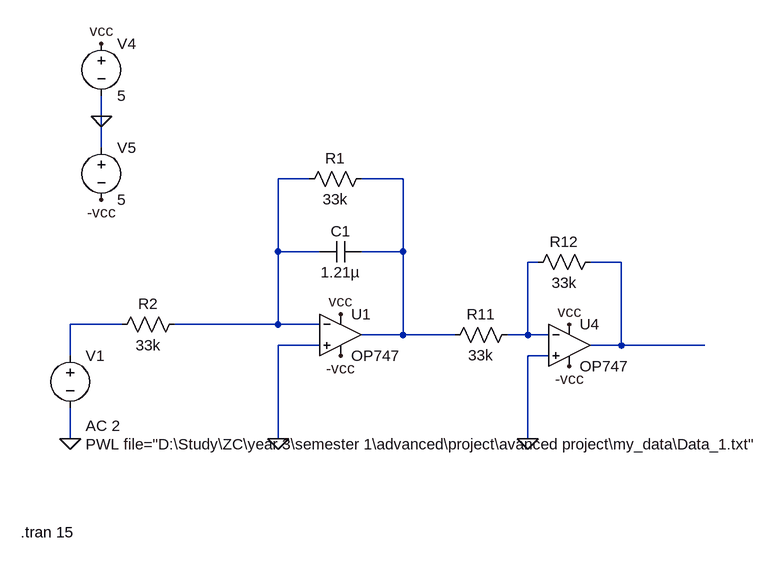
[diagram p0: schematic LTSpice.asc]
LTSpice.asc, the LTspice schematic file:
Version 4
SHEET 1 1144 680
WIRE -16 -16 -16 -48
WIRE -16 32 -16 -16
WIRE 304 80 256 80
WIRE 448 80 384 80
WIRE 256 192 256 80
WIRE 320 192 256 192
WIRE 448 192 448 80
WIRE 448 192 384 192
WIRE 656 208 640 208
WIRE 784 208 736 208
WIRE 16 304 -64 304
WIRE 256 304 256 192
WIRE 256 304 96 304
WIRE 320 304 256 304
WIRE 448 320 448 192
WIRE 448 320 384 320
WIRE 528 320 448 320
WIRE 640 320 640 208
WIRE 640 320 608 320
WIRE 672 320 640 320
WIRE 320 336 256 336
WIRE 784 336 784 208
WIRE 784 336 736 336
WIRE 912 336 784 336
WIRE -64 352 -64 304
WIRE 672 352 640 352
WIRE -64 480 -64 432
WIRE 256 480 256 336
WIRE 640 480 640 352
FLAG -16 -16 0
FLAG -16 -128 vcc
FLAG -16 112 -vcc
FLAG 352 288 vcc
FLAG 352 352 -vcc
FLAG -64 480 0
FLAG 256 480 0
FLAG 704 304 vcc
FLAG 704 368 -vcc
FLAG 640 480 0
SYMBOL res 400 64 R90
WINDOW 0 0 56 VBottom 2
WINDOW 3 32 56 VTop 2
SYMATTR InstName R1
SYMATTR Value 33k
SYMBOL cap 384 176 R90
WINDOW 0 0 32 VBottom 2
WINDOW 3 32 32 VTop 2
SYMATTR InstName C1
SYMATTR Value 1.21µ
SYMBOL res 112 288 R90
WINDOW 0 0 56 VBottom 2
WINDOW 3 32 56 VTop 2
SYMATTR InstName R2
SYMATTR Value 33k
SYMBOL OpAmps\\OP747 352 256 R0
SYMATTR InstName U1
SYMBOL voltage -64 336 R0
WINDOW 3 24 152 Left 2
WINDOW 123 24 124 Left 2
WINDOW 39 0 0 Left 0
SYMATTR Value PWL file="D:\Study\ZC\year 3\semester 1\advanced\project\avanced project\my_data\Data_1.txt"
SYMATTR Value2 AC 2
SYMATTR InstName V1
SYMBOL voltage -16 -144 R0
WINDOW 123 0 0 Left 0
WINDOW 39 0 0 Left 0
SYMATTR InstName V4
SYMATTR Value 5
SYMBOL voltage -16 16 R0
WINDOW 123 0 0 Left 0
WINDOW 39 0 0 Left 0
SYMATTR InstName V5
SYMATTR Value 5
SYMBOL res 624 304 R90
WINDOW 0 0 56 VBottom 2
WINDOW 3 32 56 VTop 2
SYMATTR InstName R11
SYMATTR Value 33k
SYMBOL OpAmps\\OP747 704 272 R0
SYMATTR InstName U4
SYMBOL res 752 192 R90
WINDOW 0 0 56 VBottom 2
WINDOW 3 32 56 VTop 2
SYMATTR InstName R12
SYMATTR Value 33k
TEXT -140 624 Left 2 !.tran 15

The netlist it stands for:
* LTSpice.asc
R1 N002 N001 33k
C1 N002 N001 1.21µ
R2 N001 N005 33k
XU1 0 N001 vcc -vcc N002 OP747  ; pins In+ In- V+ V- OUT
V1 N005 0 PWL file="D:\Study\ZC\year 3\semester 1\advanced\project\avanced project\my_data\Data_1.txt" AC 2
V4 vcc 0 5
V5 0 -vcc 5
R11 N003 N002 33k
XU4 0 N003 vcc -vcc N004 OP747  ; pins In+ In- V+ V- OUT
R12 N004 N003 33k
.tran 15
.backanno
.end